# Altium schematic sheet 5VoltRegulator.SchDoc
size A
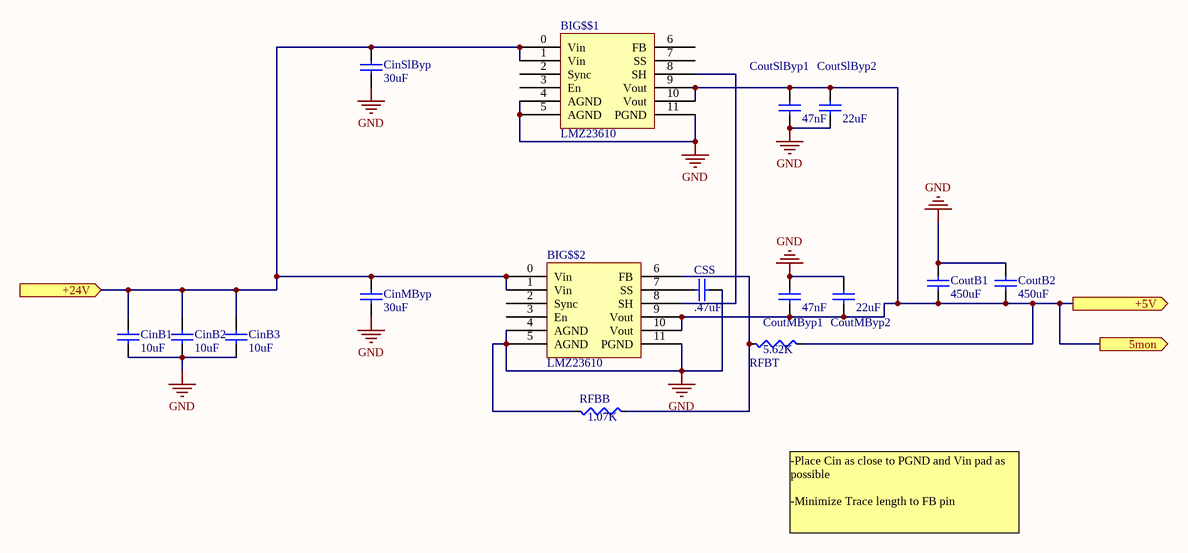
[diagram p0: 5VoltRegulator.SchDoc]

## Parts
BIG$$1  LMZ23610  [LMZ23610]
BIG$$2  LMZ23610  [LMZ23610]
CinB1  10uF  [0805 (2012) Capacitor]
CinB2  10uF  [0805 (2012) Capacitor]
CinB3  10uF  [0805 (2012) Capacitor]
CinMByp  30uF  [0805 (2012) Capacitor]
CinSlByp  30uF  [0805 (2012) Capacitor]
CoutB1  450uF  [0805 (2012) Capacitor]
CoutB2  450uF  [0805 (2012) Capacitor]
CoutMByp1  47nF  [0805 (2012) Capacitor]
CoutMByp2  22uF  [0805 (2012) Capacitor]
CoutSlByp1  47nF  [0805 (2012) Capacitor]
CoutSlByp2  22uF  [0805 (2012) Capacitor]
CSS  .47uF  [0805 (2012) Capacitor]
RFBB  1.07K  [R 0805 (2012) RESISTOR]
RFBT  5.62K  [R 0805 (2012) RESISTOR]

## Ports
5mon (out), +5V (out), +24V (in)

## Nets
GND: BIG$$1.4(AGND) BIG$$1.5(AGND) BIG$$1.11(PGND) BIG$$2.4(AGND) BIG$$2.5(AGND) BIG$$2.11(PGND) CinB1.1 CinB2.1 CinB3.1 CinMByp.1 CinSlByp.1 CoutB1.2 CoutB2.2 CoutMByp1.2 CoutMByp2.2 CoutSlByp1.1 CoutSlByp2.1 CSS.2 RFBB.1
+5V: BIG$$1.9(Vout) BIG$$1.10(Vout) BIG$$2.9(Vout) BIG$$2.10(Vout) CoutB1.1 CoutB2.1 CoutMByp1.1 CoutMByp2.1 CoutSlByp1.2 CoutSlByp2.2 RFBT.2 ; port +5V, port 5mon
+24V: BIG$$1.0(Vin) BIG$$1.1(Vin) BIG$$2.0(Vin) BIG$$2.1(Vin) CinB1.2 CinB2.2 CinB3.2 CinMByp.2 CinSlByp.2 ; port +24V
NetBIG$$1_8: BIG$$1.8(SH) BIG$$2.8(SH)
NetBIG$$2_6: BIG$$2.6(FB) RFBB.2 RFBT.1
NetBIG$$2_7: BIG$$2.7(SS) CSS.1

Not connected (* = marked no-connect by the designer): BIG$$1 2(Sync) 3(En) 6(FB) 7(SS); BIG$$2 2(Sync) 3(En)

## Notes on the sheet
- -Place Cin as close to PGND and Vin pad as possible
  -Minimize Trace length to FB pin

## Library data of the parts
CinB1-CinB3 CinMByp CinSlByp CoutB1 CoutB2 CoutMByp1 CoutMByp2 CoutSlByp1 CoutSlByp2 CSS = Capacitor (non-polarized): Capacitor; Value: .1uF
RFBB RFBT = Resistor: Value: 0Ohm